# Altium schematic sheet ARC.SchDoc
size A3; SheetNumber: 2; SheetTotal: 6
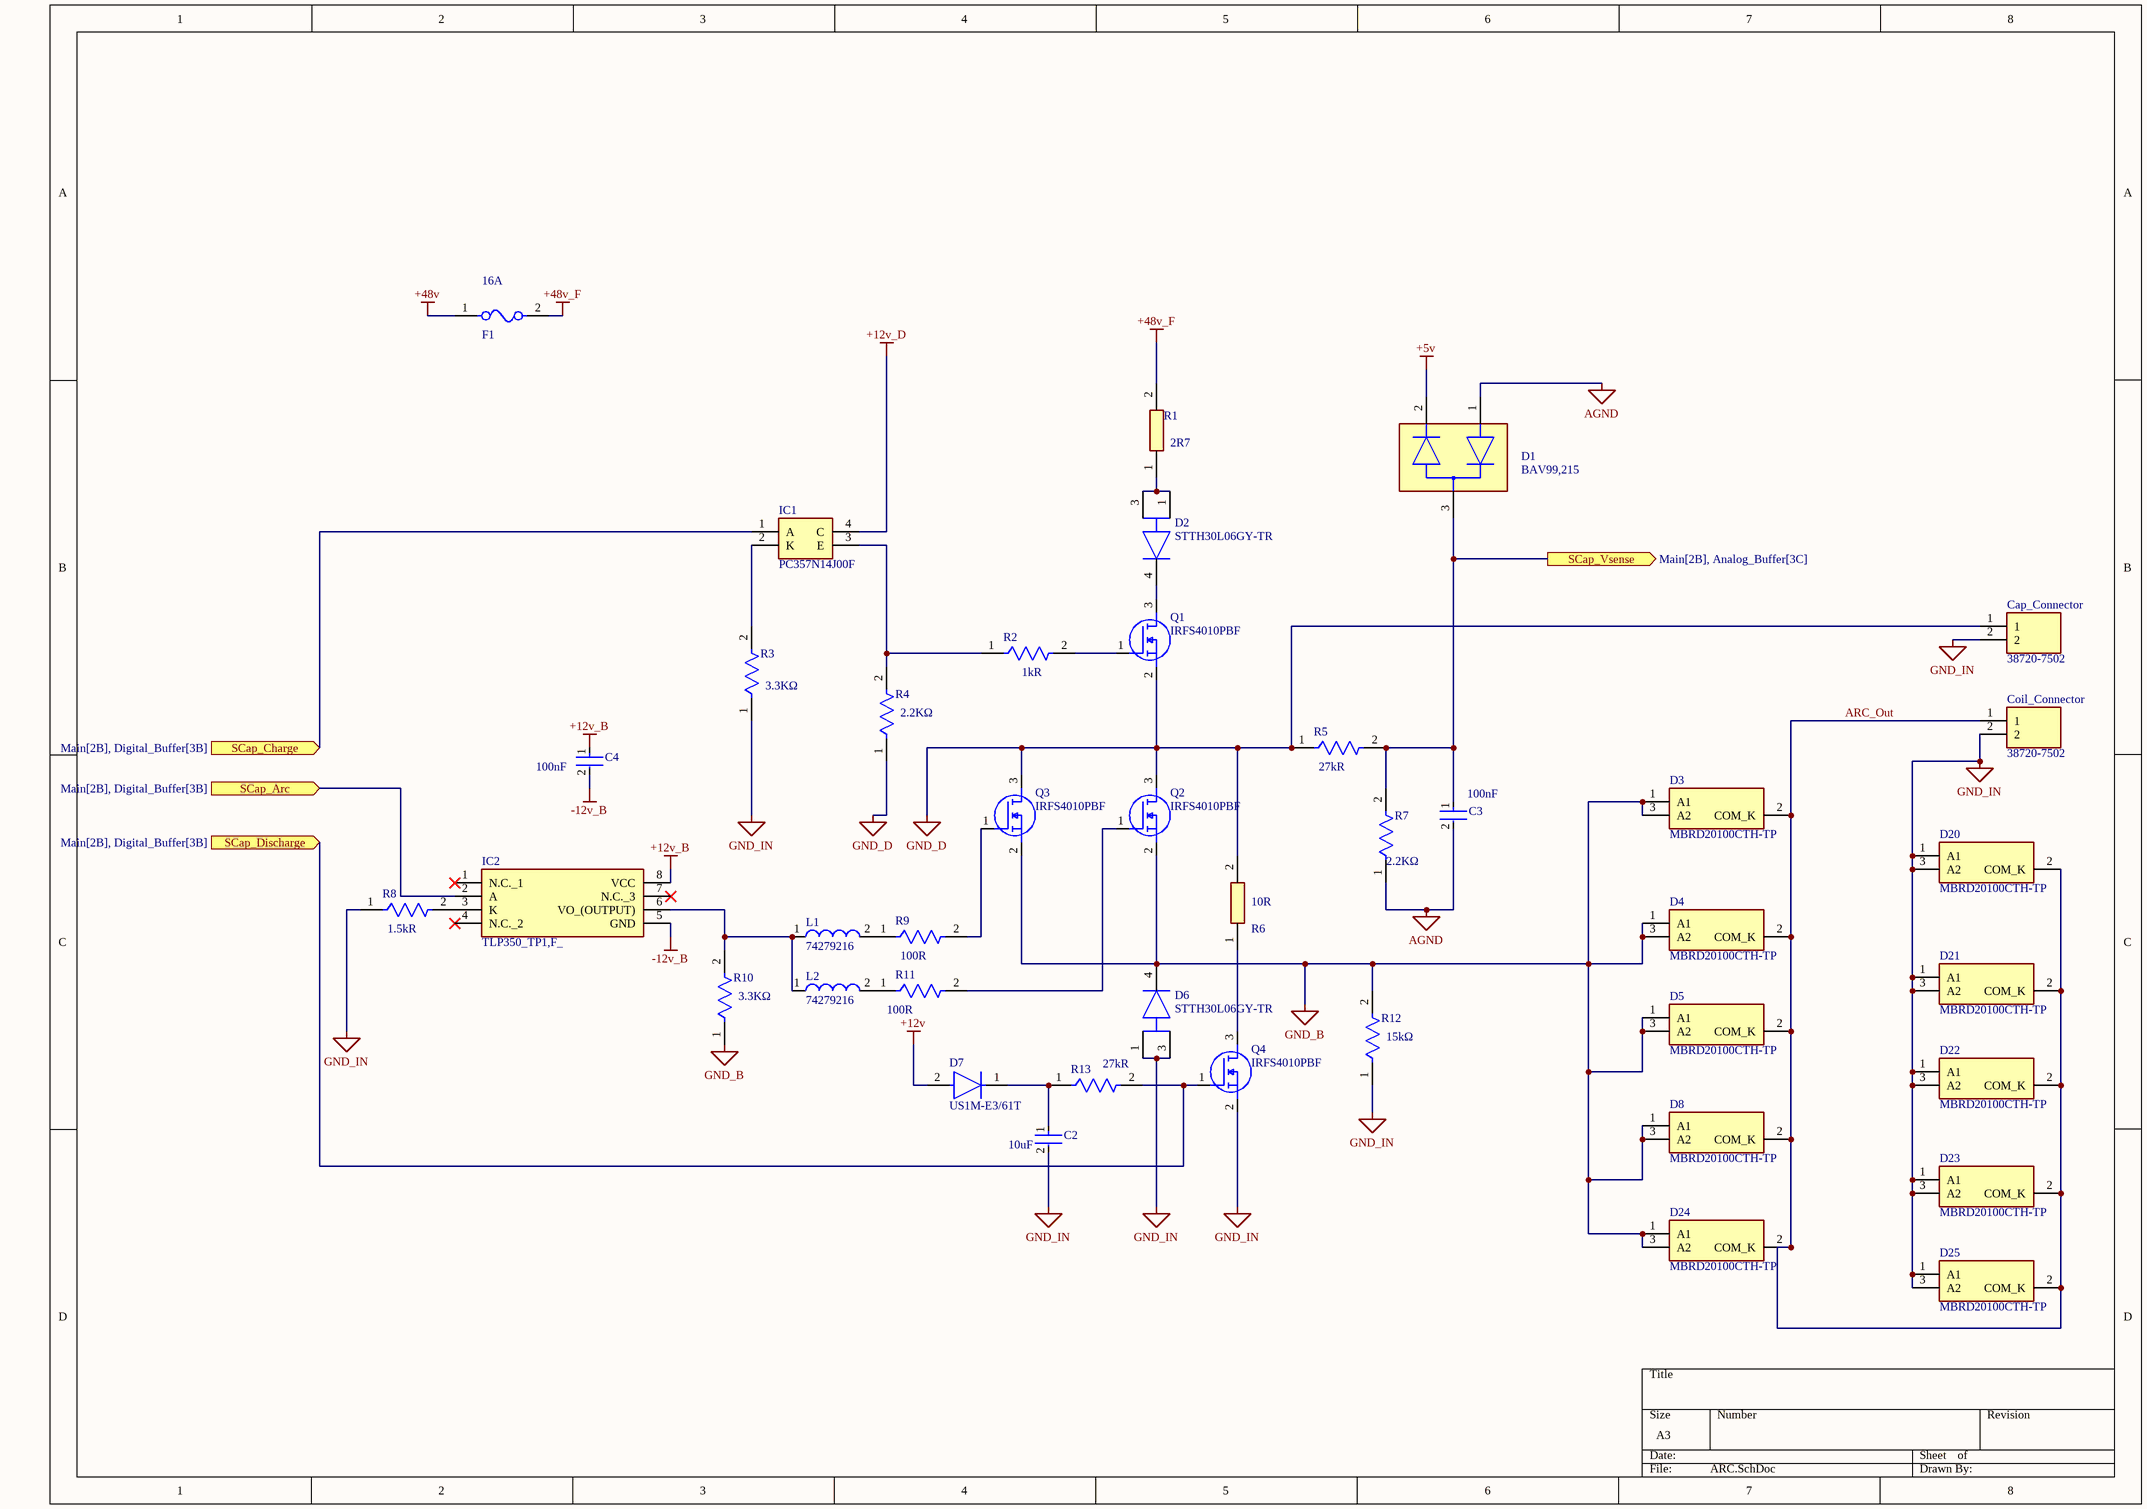
[diagram p0: ARC.SchDoc]

## Parts
C2  Capacitance: 10uF  [FP-GRM31C-0_2-e0_3_0_8-MFG]  (hidden comment: GRM31CR71E106KA12L)
C3  Capacitance: 100nF  [FP-1206-L_3_2_0_2-W_1_6_0-MFG]  (hidden comment: 12065C104KAT2A)
C4  Capacitance: 100nF  [FP-1206-L_3_2_0_2-W_1_6_0-MFG]  (hidden comment: 12065C104KAT2A)
Cap_Connector  38720-7502  [387207502]
Coil_Connector  38720-7502  [387207502]
D1  BAV99,215  [FP-SOT23-MFG]
D2  STTH30L06GY-TR  [FP-D2PAK-MFG]
D3  MBRD20100CTH-TP  [MBRD20100CTHTP]
D4  MBRD20100CTH-TP  [MBRD20100CTHTP]
D5  MBRD20100CTH-TP  [MBRD20100CTHTP]
D6  STTH30L06GY-TR  [FP-D2PAK-MFG]
D7  US1M-E3/61T  [FP-95400-MFG]
D8  MBRD20100CTH-TP  [MBRD20100CTHTP]
D20  MBRD20100CTH-TP  [MBRD20100CTHTP]
D21  MBRD20100CTH-TP  [MBRD20100CTHTP]
D22  MBRD20100CTH-TP  [MBRD20100CTHTP]
D23  MBRD20100CTH-TP  [MBRD20100CTHTP]
D24  MBRD20100CTH-TP  [MBRD20100CTHTP]
D25  MBRD20100CTH-TP  [MBRD20100CTHTP]
F1  Fuse Current: 16A  [FP-0031_8231-MFG]  (hidden comment: 0031.8231)
IC1  PC357N14J00F  [SOP254P675X300-4N]
IC2  TLP350_TP1,F_  [DIP762W60P254L966H485Q8N]
L1  74279216  [SMD-1206]
L2  74279216  [SMD-1206]
Q1  IRFS4010PBF  [IDB30E60]
Q2  IRFS4010PBF  [IDB30E60]
Q3  IRFS4010PBF  [IDB30E60]
Q4  IRFS4010PBF  [IDB30E60]
R1  value 2R7  [CP001027K00JE663]  (hidden comment: CP001010R00JE66)
R2  Resistance: 1kR  [FP-CR1206-IPC_A]  (hidden comment: CR1206-FX-1001ELF)
R3  value 3.3KΩ  [FP-CRGCQ1206-IPC_C]  (hidden comment: CRGCQ1206J3K3)
R4  value 2.2KΩ  [FP-CRGCQ1206-IPC_C]  (hidden comment: CRGCQ1206J2K2)
R5  Resistance: 27kR  [FP-RC3216-IPC_A]  (hidden comment: RC3216J273CS)
R6  value 10R  [CP001027K00JE663]  (hidden comment: CP001010R00JE66)
R7  value 2.2KΩ  [FP-CRGCQ1206-IPC_C]  (hidden comment: CRGCQ1206J2K2)
R8  Resistance: 1.5kR  [FP-CRCW1206-e3-IPC_C]  (hidden comment: CRCW12061K50FKEA)
R9  Resistance: 100R  [FP-CRCW1206-e3-MFG]  (hidden comment: CRCW1206100RFKEA)
R10  Resistance: 3.3KΩ  [FP-CRGCQ1206-IPC_C]  (hidden comment: CRGCQ1206F3K3)
R11  Resistance: 100R  [FP-CRCW1206-e3-MFG]  (hidden comment: CRCW1206100RFKEA)
R12  Resistance: 15kΩ  [FP-ERJ8EN-MFG]  (hidden comment: ERJ-8ENF1502V)
R13  Resistance: 27kR  [FP-RC3216-IPC_A]  (hidden comment: RC3216J273CS)

## Ports
SCap_Arc (in, see Main[2B], Digital_Buffer[3B]), SCap_Charge (in, see Main[2B], Digital_Buffer[3B]), SCap_Discharge (in, see Main[2B], Digital_Buffer[3B]), SCap_Vsense (out, see Main[2B], Analog_Buffer[3C])

## Nets
+5v: D1.2
+12v: D7.2(A)
+12v_B: C4.1 IC2.8(VCC)
+12v_D: IC1.4(C)
+48v: F1.1
+48v_F: F1.2 R1.2
-12v_B: C4.2 IC2.5(GND)
AGND: C3.2 D1.1 R7.1
GND_B: D3.1(A1) D3.3(A2) D4.1(A1) D4.3(A2) D5.1(A1) D5.3(A2) D6.4(K) D8.1(A1) D8.3(A2) D24.1(A1) D24.3(A2) Q2.2(S) Q3.2(S) R10.1 R12.2
GND_D: Cap_Connector.1 Q1.2(S) Q2.3(D) Q3.3(D) R4.1 R5.1 R6.2
GND_IN: C2.2 Cap_Connector.2 Coil_Connector.2 D6.1(A) D6.3(A) D20.1(A1) D20.3(A2) D21.1(A1) D21.3(A2) D22.1(A1) D22.3(A2) D23.1(A1) D23.3(A2) D25.1(A1) D25.3(A2) Q4.2(S) R3.1 R8.1 R12.1
ARC_Out: Coil_Connector.1 D3.2(COM_K) D4.2(COM_K) D5.2(COM_K) D8.2(COM_K) D20.2(COM_K) D21.2(COM_K) D22.2(COM_K) D23.2(COM_K) D24.2(COM_K) D25.2(COM_K)
SCap_Arc: IC2.2(A) ; port SCap_Arc
SCap_Charge: IC1.1(A) ; port SCap_Charge
SCap_Discharge: Q4.1(G) R13.2 ; port SCap_Discharge
SCap_Vsense: C3.1 D1.3 R5.2 R7.2 ; port SCap_Vsense
NetC2_1: C2.1 D7.1(C) R13.1
NetD2_1: D2.1(A) D2.3(A) R1.1
NetD2_4: D2.4(K) Q1.3(D)
NetIC1_2: IC1.2(K) R3.2
NetIC1_3: IC1.3(E) R2.1 R4.2
NetIC2_3: IC2.3(K) R8.2
NetIC2_6: IC2.6(VO_(OUTPUT)) L1.1 L2.1 R10.2
NetL1_2: L1.2 R9.1
NetL2_2: L2.2 R11.1
NetQ1_1: Q1.1(G) R2.2
NetQ2_1: Q2.1(G) R11.2
NetQ3_1: Q3.1(G) R9.2
NetQ4_3: Q4.3(D) R6.1

Not connected (* = marked no-connect by the designer): IC2 1(N.C._1)* 4(N.C._2)* 7(N.C._3)*

## Library data of the parts
C2 = CMP-06035-003589-1: Chip Multilayer Ceramic Capacitors for General Purpose, 1206, 10uF, X7R, 15%, 10%, 25V; Case Code (Imperial): 1206; Voltage Rating (DC): 25V; Voltage Rating: 25V; Length: 3.2mm; Lead Free: Lead Free; Thickness: 0.071inch; Package Quantity: 1; Width: 1.6mm; Max Operating Temperature: 125°C; Number of Pins: 2; Height: 1.6mm; Case Code (Metric): 3216; REACH SVHC: No SVHC; Radiation Hardening: No; Case/Package: 1206; Material: Ceramic; Tolerance: 10%; Voltage: 25V; Mount: Surface Mount; Packaging: Tape and Reel; Dielectric: X7R; Termination: SMD/SMT; Min Operating Temperature: -55°C; Depth: 1.6mm
C3 C4 = CMP-2000-05018-2: General Purpose Ceramic Capacitor, 1206, 100nF, 10%, X7R, 15%, 50V; Dissipation Factor: 2.5%; Insulation Resistance: 100GR; Dielectric: X7R; Thickness: 0.037inch; Case Code (Imperial): 1206; Case Code (Metric): 3216; Dielectric Material: Ceramic; Width: 1.6mm; Voltage Rating (DC): 50V; Termination: SMD/SMT; Tolerance: 10%; REACH SVHC: No SVHC; Height: 0.94mm; Length: 3.2mm; Voltage: 50V; Packaging: Tape and Reel; Depth: 1.6mm; Voltage Rating: 50V; Series: -; Contact Plating: Tin; Mount: Surface Mount; Package Quantity: 1; Construction: Flat; Max Operating Temperature: 125°C; Min Operating Temperature: -55°C; Case/Package: 1206; Lead Free: Lead Free; RoHS Compliant: Yes; Number of Pins: 2; Radiation Hardening: No
Cap_Connector Coil_Connector = 38720-7502: Connector; Manufacturer_Name: Molex; Datasheet Link: https://componentsearchengine.com/Datasheets/2/38720-7502.pdf; Height: 16.8mm; Manufacturer_Part_Number: 38720-7502; Mouser Part Number: 538-38720-7502; Mouser Price/Stock: https://www.mouser.co.uk/ProductDetail/Molex/38720-7502?qs=u6Gr9%2FNt%252B%2F8PORak8KlQTw%3D%3D
D1 = CMP-14399-000006-1: DIODE ARRAY GP 100V 215MA SOT23
D2 D6 = CMP-12188-000013-1: DIODE GEN PURP 600V 30A D2PAK; Manufacturer: STMicroelectronics; Automotive Grade: Grade 0; Max Junction Temp: +175°C; Standoff Height: 0.03mm; Max Surge Forward Current: 300A; Peak Reverse Current: 25uA; RoHS: TRUE; Temperature Range High: +175°C; ComponentLink2Description: Datasheet; Octopart: https://octopart.com/stth30l06gy-tr-stmicroelectronics-26451410; Manufacturer Part Number: STTH30L06GY-TR; Device Class L2: Diodes; Forward Current: 30A; Device Class L3: Rectifier Diodes; Digikey Description: DIODE GEN PURP 600V 30A D2PAK; Temperature: -40°C to +175°C; Temperature Range Low: -40°C; Max Repetitive Reverse Voltage: 600V; Category: Diode; Automotive: Yes; Package: D2PAK; Lead Free: Yes; Height: 4.83mm; Device Class L1: Discrete Semiconductors; ComponentLink2URL: https://www.st.com/resource/en/datasheet/stth30l06-y.pdf
D3-D5 D8 D20-D25 = MBRD20100CTH-TP: Schottky Diode; Manufacturer_Name: MCC; Datasheet Link: https://www.mccsemi.com/pdf/Products/MBRD20100CTH_MBRD20200CTH(DPAK).pdf; Height: 2.53mm; Manufacturer_Part_Number: MBRD20100CTH-TP; Mouser Part Number: 833-MBRD20100CTH-TP; Mouser Price/Stock: https://www.mouser.co.uk/ProductDetail/Micro-Commercial-Components-MCC/MBRD20100CTH-TP?qs=P1JMDcb91o6x6WEAXuWakg%3D%3D; Arrow Part Number: MBRD20100CTH-TP; Arrow Price/Stock: https://www.arrow.com/en/products/mbrd20100cth-tp/micro-commercial-components?region=europe
D7 = CMP-02540-000006-1: DIODE GEN PURP 1KV 1A DO214AC; Manufacturer: Vishay; Reverse Voltage: 1000V; Max Junction Temp: +150°C; Peak Reverse Current: 10uA; Max Surge Forward Current: 30A; Capacitance: 10pF; Standoff Height: 0mm; Value: 10pF; Temperature Range Low: -55°C; Footprint Url: https://www.vishay.com/docs/95400/sma.pdf; Device Class L1: Discrete Semiconductors; Temperature: -55°C to +150°C; Max Repetitive Reverse Voltage: 1000V; ComponentLink2URL: https://www.vishay.com/docs/88768/us1.pdf; Category: Diode; Octopart: https://octopart.com/us1m-e3%2F61t-vishay-39553152; Digikey Description: DIODE GEN PURP 1KV 1A DO214AC; Device Class L2: Diodes; ComponentLink2Description: Datasheet; Height: 2.29mm; Automotive: No; RoHS: TRUE; Mouser Description: On a Reel of 1800, Vishay 1000V 1A, Silicon Junction Diode, 2-Pin DO-214AC US1M-E3/61T; Package: 95400; Forward Current: 1A; Temperature Range High: +150°C; Device Class L3: Rectifier Diodes; Manufacturer Part Number: US1M-E3/61T; Lead Free: Yes
F1 = CMP-26292-000005-1: FUSE BLOK CARTRIDGE 600V 16A PCB; Manufacturer: Schurter; Voltage Rating Ac: 500V; Number Of Fuses: 1; Standoff Height: 0.7mm; Conn Orientation: Horizontal; ComponentLink2URL: https://www.schurter.com/en/datasheet/typ_OGD.pdf; Voltage Rating Dc: 600V; Package: 0; Device Class L3: unset; Digikey Description: FUSE BLOK CARTRIDGE 600V 16A PCB; Mouser Description: Fuse Holder OGD FUSEHOLDER 5X20/6.3X32; Category: Fuse; Device Class L2: Fuse Holders; Height: 12.7mm; ComponentLink2Description: Datasheet; Ambient Temperature Range Low: -40°C; Ambient Temperature Range High: +85°C; Octopart: https://octopart.com/0031.8231-schurter-8659; Automotive: No; RoHS: TRUE; Lead Free: Yes; Device Class L1: Circuit Protection; Manufacturer Part Number: 0031.8231
IC1 = PC357N14J00F: Integrated Circuit; Manufacturer_Name: Sharp Microelectronics; Height: 3mm; Manufacturer_Part_Number: PC357N14J00F
IC2 = TLP350_TP1,F_: Integrated Circuit; Manufacturer_Name: Toshiba; Manufacturer_Part_Number: TLP350(TP1,F); Datasheet Link: https://toshiba.semicon-storage.com/info/docget.jsp?did=6217&prodName=TLP350; Height: 4.85mm; Mouser Part Number: 757-TLP350(TP1,F); Mouser Price/Stock: https://www.mouser.co.uk/ProductDetail/Toshiba/TLP350TP1F?qs=f0GatGUIxV3mNWWzK5NBiQ%3D%3D; Arrow Part Number: TLP350(TP1,F); Arrow Price/Stock: https://www.arrow.com/en/products/tlp350-tp1f/toshiba?region=asia
L1 L2 = CMP-0220-00014-1: SMD EMI Suppression Ferrite Bead WE-CBF, Z = 1200 Ohm; PackageDescription: Chip Inductor, 2-Leads, Body 3.2 x 1.6 mm; PackageVersion: 2007; ComponentLink2URL: http://www.we-online.de/katalog/media/pdf/74279216.pdf; PackageReference: SMD-1206; ComponentLink2Description: Datasheet; ComponentLink1Description: Manufacturer Link; Impedance: 1200 Ohm; DatasheetVersion: Dec-2005; ComponentLink1URL: http://www.we-online.com
Q1-Q4 = IRFS4010PBF: MOSFET (N-Channel); Manufacturer_Name: Infineon; Datasheet Link: http://uk.rs-online.com/web/p/products/6887080; Manufacturer_Part_Number: IRFS4010PBF; Mouser Part Number: 942-IRFS4010PBF; Mouser Price/Stock: https://www.mouser.com/Search/Refine.aspx?Keyword=942-IRFS4010PBF
R1 R6 = CP001010R00JE66: Resistor; Manufacturer_Name: Vishay; Datasheet Link: https://www.vishay.com/docs/30113/cphivol.pdf; Height: 13.5mm; Manufacturer_Part_Number: CP001010R00JE66; Mouser Part Number: 71-CP001010R00JE66; Mouser Price/Stock: https://www.mouser.com/Search/Refine.aspx?Keyword=71-CP001010R00JE66; Arrow Part Number: CP001010R00JE66; Arrow Price/Stock: https://www.arrow.com/en/products/cp001010r00je66/vishay
R2 = CMP-07231-002641-1: Thick Film Chip Resistors 1206 1kΩ 0.25W 1% 100ppm/°C; Voltage Rating: 200V; Max Power Dissipation: 250mW; REACH SVHC: No SVHC; Radiation Hardening: No; Number of Terminations: 2; Max Operating Temperature: 155°C; Temperature Coefficient: 100ppm/°C; Voltage Rating (DC): 200V; Tolerance: 1%; Composition: Thick Film; Case Code (Imperial): 1206; Mount: Surface Mount; Width: 1.6mm; Min Operating Temperature: -55°C; Height: 0.6mm; Packaging: Tape and Reel; Number of Pins: 2; Package Quantity: 1; Military Standard: Not; Length: 3.2mm; Thickness: 610um; Case Code (Metric): 3216; Case/Package: 1206; Contact Plating: Tin; Power Rating: 250mW; Termination: SMD/SMT; Depth: 1.6mm; Features: Moisture Resistant
R3 = CMP-03211-010046-1: CRGCQ1206 3.3KΩ 0.25W 5% ±100ppm/°C 200V; Manufacturer: TE Connectivity; Tolerance: 0.05; Automotive Grade: Grade 800; Temperature Coefficient: ±100ppm/°C; Device Class L2: Resistors; Device Class L1: Passive Components; Octopart: https://octopart.com/crgcq1206j3k3-te+connectivity-91018329; Resistance: 3.3KΩ; Ambient Temperature Range High: +70°C; ComponentLink2URL: https://www.te.com/commerce/DocumentDelivery/DDEController?Action=showdoc&DocId=Data+Sheet%7F1773204-3%7F1%7Fpdf%7FEnglish%7FENG_DS_1773204-3_1.pdf%7F4-2176347-809; Device Class L3: Chip SMD Resistors; Manufacturer Part Number: CRGCQ1206J3K3; ComponentLink2Description: Datasheet; Height: 0.65mm; Lead Free: Yes; Power Rating: 0.25W; Category: Res; Temperature: -55°C to +155°C; Composition: Thick Film; Package: CRGCQ1206; Temperature Range High: +155°C; Voltage Rating: 200V; Temperature Range Low: -55°C; Automotive: Yes; RoHS: TRUE; Series: CRGCQ; Ipc Land Pattern Name: RESC310155X55
R4 R7 = CMP-03211-005605-1: CRGCQ 1206 2K2 5%; Manufacturer: TE Connectivity; Automotive Grade: Grade 758; Tolerance: 0.05; Voltage Rating: 200V; Temperature Coefficient: ±100ppm/°C; Power Rating: 0.25W; Device Class L2: Resistors; Lead Free: Yes; ComponentLink2URL: https://www.te.com/commerce/DocumentDelivery/DDEController?Action=showdoc&DocId=Data+Sheet%7F1773204-3%7F1%7Fpdf%7FEnglish%7FENG_DS_1773204-3_1.pdf%7F4-2176347-767; RoHS: TRUE; Resistance: 2.2KΩ; Category: Res; Series: CRGCQ; Height: 0.65mm; Digikey Description: CRGCQ 1206 2K2 5%; Manufacturer Part Number: CRGCQ1206J2K2; Temperature: -55°C to +155°C; ComponentLink2Description: Datasheet; Device Class L3: Chip SMD Resistors; Temperature Range Low: -55°C; Composition: Thick Film; Ambient Temperature Range High: +70°C; Temperature Range High: +155°C; Package: CRGCQ1206; Octopart: https://octopart.com/crgcq1206j2k2-te+connectivity-91018322; Device Class L1: Passive Components; Ipc Land Pattern Name: RESC310155X55; Automotive: Yes
R5 R13 = CMP-13261-004377-1: Res Thick Film 1206 27kΩ 5% 0.25W ±100ppm/°C Molded SMD T/R; Voltage Rating (DC): 200V; Max Power Dissipation: 250mW; Height: 0.026inch; Case Code (Imperial): 1206; Contact Plating: Tin; Features: Moisture Resistant; Case Code (Metric): 3216; Length: 0.126inch; Case/Package: 1206; Packaging: Tape and Reel; Temperature Coefficient: 100ppm/°C; Number of Terminations: 2; Min Operating Temperature: -55°C; Tolerance: 5%; Radiation Hardening: No; Composition: Thick Film; Width: 0.063inch; Lead Free: Lead Free; Max Operating Temperature: 155°C
R8 = CMP-02407-002229-1: RES Thick Film, 1.5kΩ, 1%, 0.25W, 100ppm/°C, 1206; Voltage Rating (DC): 200V; Power Rating: 250mW; Depth: 1.6mm; Case/Package: 1206; Packaging: Tape and Reel; Military Standard: Not; Radiation Hardening: No; Features: Automotive AEC-Q200; Number of Terminations: 2; Case Code (Imperial): 1206; Width: 0.063inch; Voltage Rating: 200V; Tolerance: 1%; Max Operating Temperature: 155°C; Weight: 0.000353oz; Package Quantity: 10; Temperature Coefficient: 100ppm/°C; Lead Free: Lead Free; Height: 0.024inch; Max Power Dissipation: 250mW; Termination: SMD/SMT; Length: 3.2mm; Contact Plating: Tin; Composition: Thick Film; Min Operating Temperature: -55°C; Case Code (Metric): 3216
R9 R11 = CMP-2003-04801-2: RES Thick Film, 100Ω, 1%, 0.25W, 100ppm/°C, 1206; Voltage Rating (DC): 200V; Power Rating: 250mW; Case Code (Metric): 3216; Radiation Hardening: No; Height: 0.55mm; Packaging: Tape and Reel; Depth: 1.6mm; Weight: 0.000353oz; Termination: SMD/SMT; Lead Free: Lead Free; Min Operating Temperature: -55°C; Contact Plating: Tin; Max Operating Temperature: 155°C; Case Code (Imperial): 1206; Military Standard: Not; Width: 1.6mm; Number of Pins: 2; Voltage Rating: 200V; Composition: Thick Film; Package Quantity: 5000; Tolerance: 1%; Case/Package: 1206; Mount: Surface Mount; Length: 3.2mm; Temperature Coefficient: 100ppm/°C
R10 = CMP-03211-006652-1: CRGCQ1206 3.3KΩ 0.25W 1% ±100ppm/°C 200V; Manufacturer: TE Connectivity; Tolerance: 0.01; Automotive Grade: Grade 799; Height: 0.65mm; Automotive: Yes; Device Class L3: Chip SMD Resistors; Category: Res; Ambient Temperature Range High: +70°C; Mouser Description: Res Thick Film 1206 3.3K Ohm 1% 0.25W(1/4W) ±100ppm/C Pad SMD Automotive T/R; Octopart: https://octopart.com/crgcq1206f3k3-te+connectivity-91018281; ComponentLink2Description: Datasheet; RoHS: TRUE; Package: CRGCQ1206; Temperature Range High: +155°C; Series: CRGCQ; Voltage Rating: 200V; Device Class L1: Passive Components; Temperature Range Low: -55°C; Manufacturer Part Number: CRGCQ1206F3K3; Temperature Coefficient: ±100ppm/°C; ComponentLink2URL: https://www.te.com/commerce/DocumentDelivery/DDEController?Action=showdoc&DocId=Data+Sheet%7F1773204-3%7F1%7Fpdf%7FEnglish%7FENG_DS_1773204-3_1.pdf%7F4-2176347-808; Composition: Thick Film; Ipc Land Pattern Name: RESC310155X55; Device Class L2: Resistors; Lead Free: Yes; Power Rating: 0.25W; Temperature: -55°C to +155°C; Value: 3.3KΩ
R12 = CMP-2003-00118-2: NexarPartId: 55423295; Voltage Rating: 200V; Temperature Coefficient: 100ppm/°C; Max Power Dissipation: 250mW; Tolerance: 1%; Military Standard: Not; Min Operating Temperature: -55°C; Height: 600µm; Termination: SMD/SMT; Composition: Thick Film; Mount: Surface Mount; Voltage Rating (DC): 200V; Lead Free: Lead Free; Features: Automotive AEC-Q200; Radiation Hardening: No; Number of Terminations: 2; Contact Plating: Tin; Lifecycle Status: Production; Schedule B: 8533210045, 8533210045; Max Operating Temperature: 155°C; Packaging: Cut Tape (CT); Length: 3.2mm; Power Rating: 250mW; Width: 1.6mm; RoHS: Compliant; Number of Pins: 2; Depth: 1.6mm; Case Code (Imperial): 1206; Case/Package: 1206; REACH SVHC: No SVHC; Case Code (Metric): 3216